# EAGLE design Mini ELRS 2.4GHz TX (EAGLE 9.6.2)
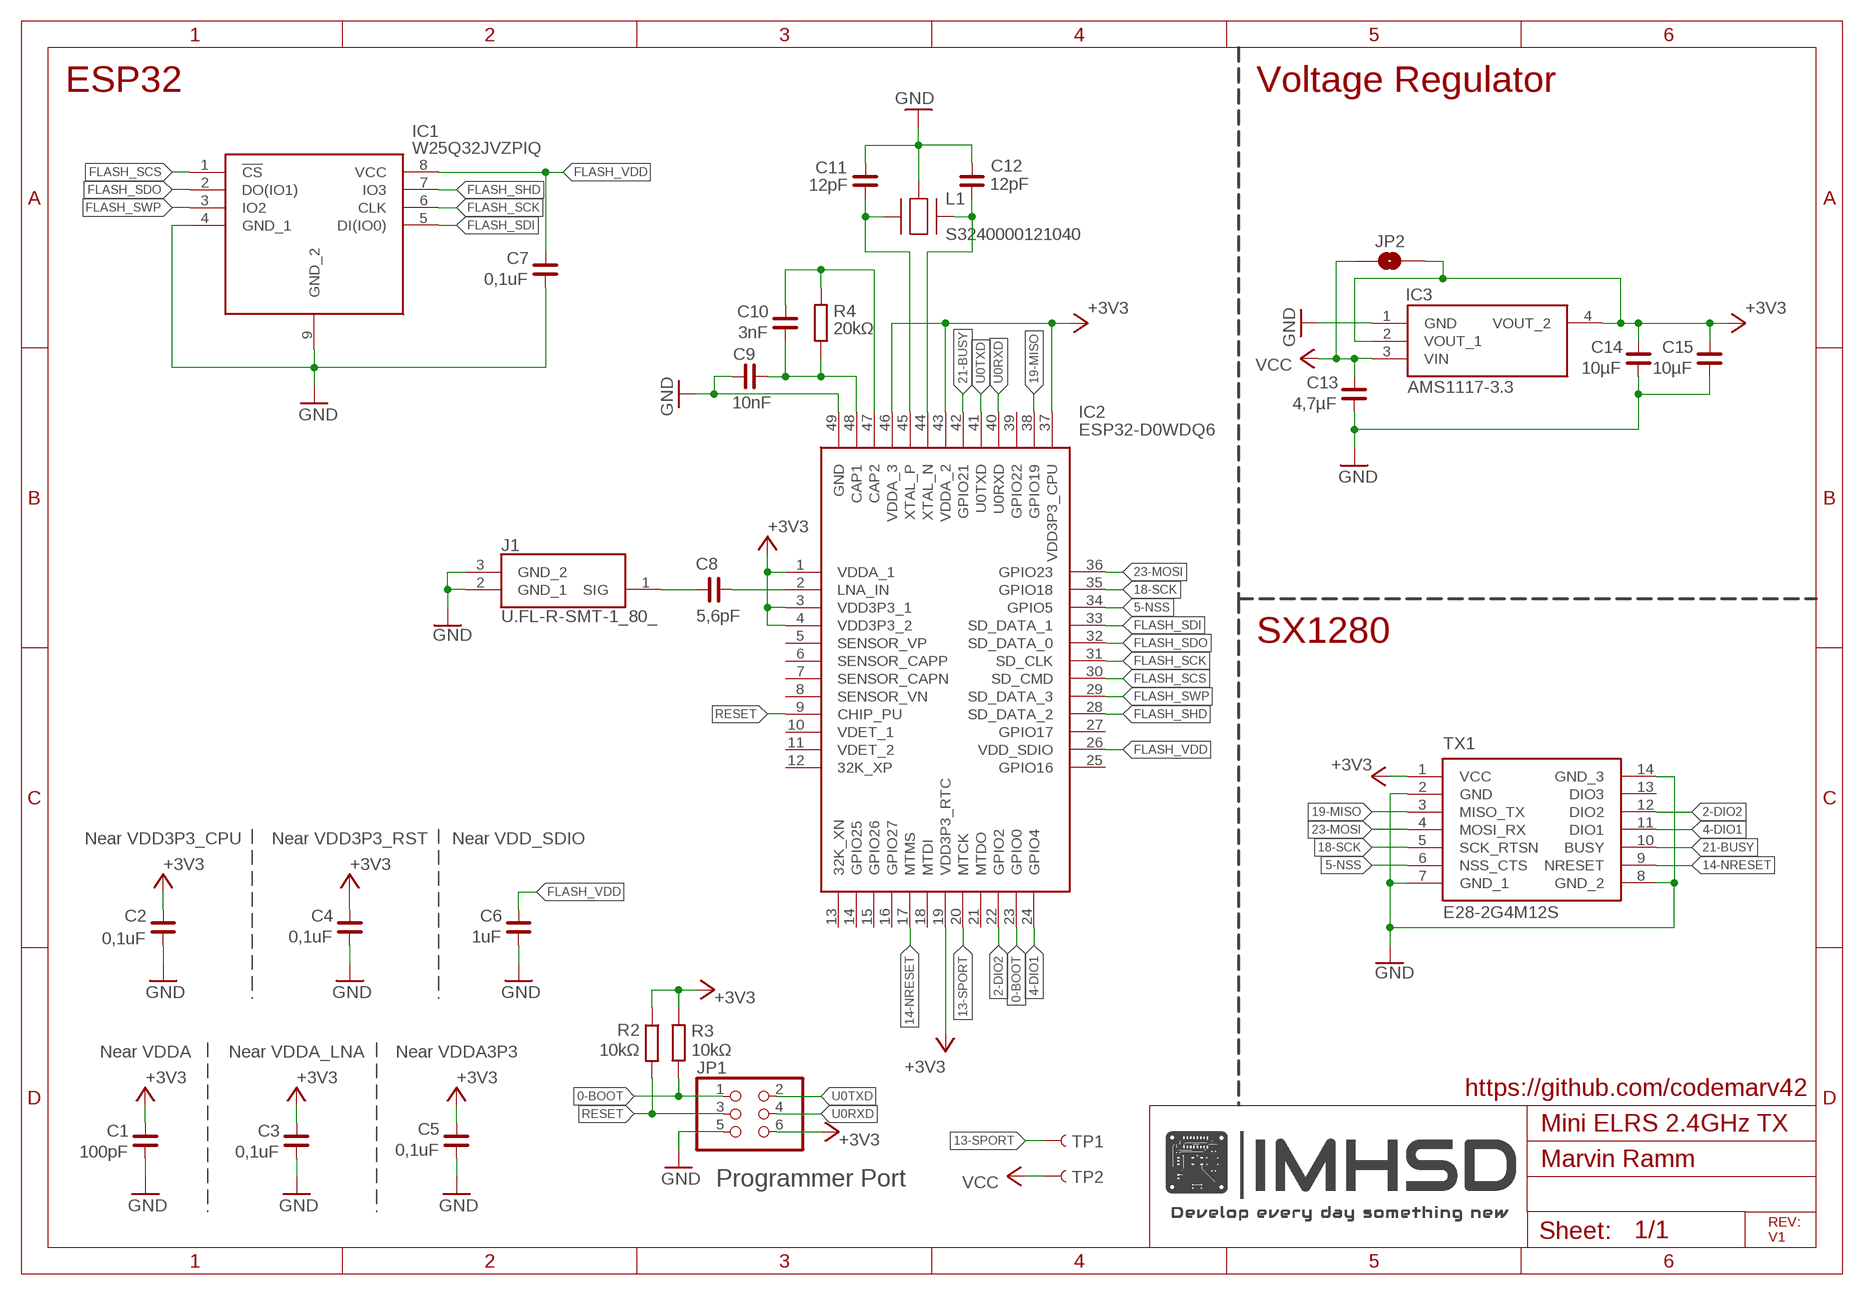
[diagram p0: schematic, sheet 1]

## Parts
C1  100pF  C_0402  [C0402]
C2  0,1uF  C_0402  [C0402]
C3  0,1uF  C_0402  [C0402]
C4  0,1uF  C_0402  [C0402]
C5  0,1uF  C_0402  [C0402]
C6  1uF  C_0402  [C0402]
C7  0,1uF  C_0402  [C0402]
C8  5,6pF  C_0402  [C0402]
C9  10nF  C_0402  [C0402]
C10  3nF  C_0402  [C0402]
C11  12pF  C_0402  [C0402]
C12  12pF  C_0402  [C0402]
C13  4,7µF  C_0603  [C0603]
C14  10µF  C_0603  [C0603]
C15  10µF  C_0603  [C0603]
IC1  W25Q128JVPIQ  [SON127P800X600X80-9N]
IC2  ESP32-D0WDQ6  [QFN40P600X600X90-49N]
IC3  AMS1117-3.3  [SOT229P700X180-4N]
J1  U.FL-R-SMT-1_80_  [UFLRSMT180]
JP1  ESP32_PRG_PORT  [ESP32_PRG_PORT]
JP2  JUMPER-SMT_2_NO_SILK  [SMT-JUMPER_2_NO_SILK]
L1  SMD-3225_4P16MHZ_20PF_10PPM_-4  [SMD3225_4P16MHZ20PF10PPM4085]
R2  10kΩ  R_0402  [R0402]
R3  10kΩ  R_0402  [R0402]
R4  20kΩ  R_0402  [R0402]
TP1  TEST-POINT3X5  [PAD.03X.05]
TP2  TEST-POINT3X5  [PAD.03X.05]
TX1  E28-2G4M12S  [E28-2G4M12S]

## Nets
0-BOOT: IC2.23(GPIO0) JP1.1 R3.2
2-DIO2: IC2.22(GPIO2) TX1.12(DIO2)
4-DIO1: IC2.24(GPIO4) TX1.11(DIO1)
5-NSS: IC2.34(GPIO5) TX1.6(NSS_CTS)
13-SPORT: IC2.20(MTCK) TP1.1
14-NRESET: IC2.17(MTMS) TX1.9(NRESET)
18-SCK: IC2.35(GPIO18) TX1.5(SCK_RTSN)
19-MISO: IC2.38(GPIO19) TX1.3(MISO_TX)
21-BUSY: IC2.42(GPIO21) TX1.10(BUSY)
23-MOSI: IC2.36(GPIO23) TX1.4(MOSI_RX)
+3V3: C1.2 C2.2 C3.2 C4.2 C5.2 C14.1 C15.1 IC2.1(VDDA_1) IC2.3(VDD3P3_1) IC2.4(VDD3P3_2) IC2.19(VDD3P3_RTC) IC2.37(VDD3P3_CPU) IC2.43(VDDA_2) IC2.46(VDDA_3) IC3.2(VOUT_1) IC3.4(VOUT_2) JP1.6 JP2.2 R2.2 R3.1 TX1.1(VCC)
FLASH_SCK: IC1.6(CLK) IC2.31(SD_CLK)
FLASH_SCS: IC1.1(!CS) IC2.30(SD_CMD)
FLASH_SDI: IC1.5(DI(IO0)) IC2.33(SD_DATA_1)
FLASH_SDO: IC1.2(DO(IO1)) IC2.32(SD_DATA_0)
FLASH_SHD: IC1.7(IO3) IC2.28(SD_DATA_2)
FLASH_SWP: IC1.3(IO2) IC2.29(SD_DATA_3)
FLASH_VDD: C6.2 C7.2 IC1.8(VCC) IC2.26(VDD_SDIO)
GND: C1.1 C2.1 C3.1 C4.1 C5.1 C6.1 C7.1 C9.1 C11.1 C12.1 C13.2 C14.2 C15.2 IC1.4(GND_1) IC1.9(GND_2) IC2.49(GND) IC3.1(GND) J1.2(GND_1) J1.3(GND_2) JP1.5 L1.2(GND_2) L1.4(GND_2) TX1.2(GND) TX1.7(GND_1) TX1.8(GND_2) TX1.14(GND_3)
N$1: C8.2 J1.1(SIG)
N$23: C8.1 IC2.2(LNA_IN)
N$24: C9.2 C10.1 IC2.48(CAP1) R4.2
N$25: C10.2 IC2.47(CAP2) R4.1
N$26: C12.2 IC2.44(XTAL_N) L1.3(CRYSTAL_2)
N$27: C11.2 IC2.45(XTAL_P) L1.1(CRYSTAL_1)
RESET: IC2.9(CHIP_PU) JP1.3 R2.1
U0RXD: IC2.40(U0RXD) JP1.4
U0TXD: IC2.41(U0TXD) JP1.2
VCC: C13.1 IC3.3(VIN) JP2.1 TP2.1
Unconnected: IC2.5(SENSOR_VP) IC2.6(SENSOR_CAPP) IC2.7(SENSOR_CAPN) IC2.8(SENSOR_VN) IC2.10(VDET_1) IC2.11(VDET_2) IC2.12(32K_XP) IC2.13(32K_XN) IC2.14(GPIO25) IC2.15(GPIO26) IC2.16(GPIO27) IC2.18(MTDI) IC2.21(MTDO) IC2.25(GPIO16) IC2.27(GPIO17) IC2.39(GPIO22) TX1.13(DIO3)

## Notes on the sheet
- ESP32 | Voltage Regulator
- W25Q32JVZPIQ
- S3240000121040
- SX1280
- Near VDD3P3_CPU | Near VDD3P3_RST | Near VDD_SDIO
- Near VDDA | Near VDDA_LNA | Near VDDA3P3
- https://github.com/codemarv42
- Marvin Ramm
- Programmer Port
- REV:
  V1

## Library data of the parts
C1-C15 = rc-master-smd:C_: NON-POLARIZED CAP
IC1 = W25Q128JVPIQ:W25Q128JVPIQ: IC FLASH 128M SPI 133MHZ 8WSON Source: Datasheet <https://www.arrow.com/en/products/w25q128jvpiq/winbond-electronics>; ARROW_PART_NUMBER: W25Q128JVPIQ; ARROW_PRICE-STOCK: https://www.arrow.com/en/products/w25q128jvpiq/winbond-electronics?region=nac; DESCRIPTION: IC FLASH 128M SPI 133MHZ 8WSON; HEIGHT: 0.8mm; MANUFACTURER_NAME: Winbond; MANUFACTURER_PART_NUMBER: W25Q128JVPIQ; MOUSER_PART_NUMBER: 454-W25Q128JVPIQ; MOUSER_PRICE-STOCK: https://www.mouser.co.uk/ProductDetail/Winbond/W25Q128JVPIQ?qs=qSfuJ%252Bfl%2Fd676hAD%252B1JSfw%3D%3D
IC2 = ESP32-D0WDQ6:ESP32-D0WDQ6: RF System on a Chip - SoC SMD IC ESP32-D0WDQ6, Dual Core MCU, WiFi & Bluetooth Combo, QFN48-pin, 6*6mm Source: Datasheet <https://www.espressif.com/sites/default/files/documentation/esp32_datasheet_en.pdf>; DESCRIPTION: RF System on a Chip - SoC SMD IC ESP32-D0WDQ6, Dual Core MCU, WiFi & Bluetooth Combo, QFN48-pin, 6*6mm; HEIGHT: 0.9mm; MANUFACTURER_NAME: Espressif Systems; MANUFACTURER_PART_NUMBER: ESP32-D0WDQ6; MOUSER_PART_NUMBER: 356-ESP32-D0WDQ6; MOUSER_PRICE-STOCK: https://www.mouser.co.uk/ProductDetail/Espressif-Systems/ESP32-D0WDQ6?qs=chTDxNqvsykWgzfXx0gR%252BQ%3D%3D
IC3 = AMS1117-3.3:AMS1117-3.3: 1A LOW DROPOUT VOLTAGE REGULATOR, SOT-223 Source: Datasheet <http://www.advanced-monolithic.com/pdf/ds1117.pdf>; ARROW_PART_NUMBER: AMS1117-3.3; DESCRIPTION: 1A LOW DROPOUT VOLTAGE REGULATOR, SOT-223; HEIGHT: 1.8mm; MANUFACTURER_NAME: Advanced Monolithic Systems; MANUFACTURER_PART_NUMBER: AMS1117-3.3
J1 = U.FL-R-SMT-1_80_:U.FL-R-SMT-1_80_: RF Connectors/Coaxial Connectors SMD RoHS Source: Datasheet <https://www.hirose.com/product/download/?distributor=digikey&type=2d&lang=en&num=U.FL-R-SMT-1(80)>; DESCRIPTION: RF Connectors/Coaxial Connectors SMD RoHS; HEIGHT: 1.45mm; MANUFACTURER_NAME: Hirose; MANUFACTURER_PART_NUMBER: U.FL-R-SMT-1(80); MOUSER_PART_NUMBER: 798-UFLRSMT180; MOUSER_PRICE-STOCK: https://www.mouser.co.uk/ProductDetail/Hirose-Connector/UFL-R-SMT-180?qs=PABxe4V6HDqFClp15N8Kig%3D%3D
JP1 = Eigene Library:ESP32_PRG_PORT
JP2 = SparkFun-Jumpers:JUMPER-SMT_2_NO: Normally open jumper This jumper has two pads in close proximity to each other. Apply solder to close the connection. Round pads are easier to solder for beginners, but are a lot larger. SparkFun Product that uses the round pads: SparkFun EL Sequencer <https://www.sparkfun.com/products/12781>
L1 = SMD-3225_4P16MHZ_20PF_10PPM_-4:SMD-3225_4P16MHZ_20PF_10PPM_-4: SMD-3225_4P16MHZ 20PF 10PPM -40~+85 Source: Datasheet <https://datasheet.lcsc.com/szlcsc/Zhejiang-Abel-Elec-SMD-3225-4P-16MHz-20pF-10ppm-40-85_C164049.pdf>; DESCRIPTION: SMD-3225_4P16MHZ 20PF 10PPM -40~+85; HEIGHT: 0.8mm; MANUFACTURER_NAME: TAE(Zhejiang Abel Elec); MANUFACTURER_PART_NUMBER: SMD-3225_4P16MHZ 20PF 10PPM -40~+85℃
R2-R4 = rc-master-smd:R_: RESISTOR
TP1 TP2 = SparkFun-Connectors:TEST-POINT: SparkFun Test Points Bare copper test points for troubleshooting or In-Circuit-Testing. These are used by our Production team for verifying production board runs using pogo-pins on test beds. SparkFun Products: SparkFun LSM9DS1 Breakout <https://www.sparkfun.com/products/13284> SparkFun PSOC <https://www.sparkfun.com/products/13714> SparkFun Load Cell Amplifier <https://www.sparkfun.com/products/13879>
TX1 = E28-2G4M12S:E28-2G4M12S; TX: >NAME

## Board
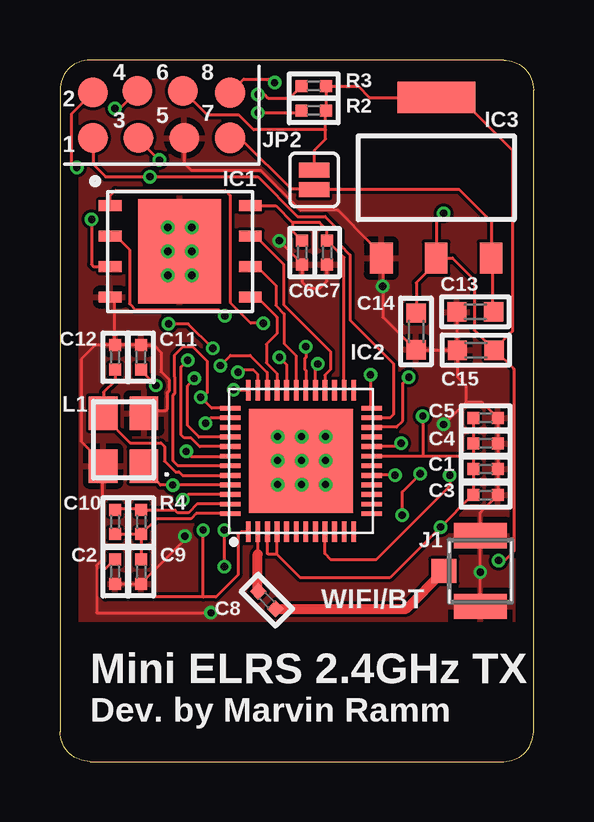
[diagram p1: board, top side]
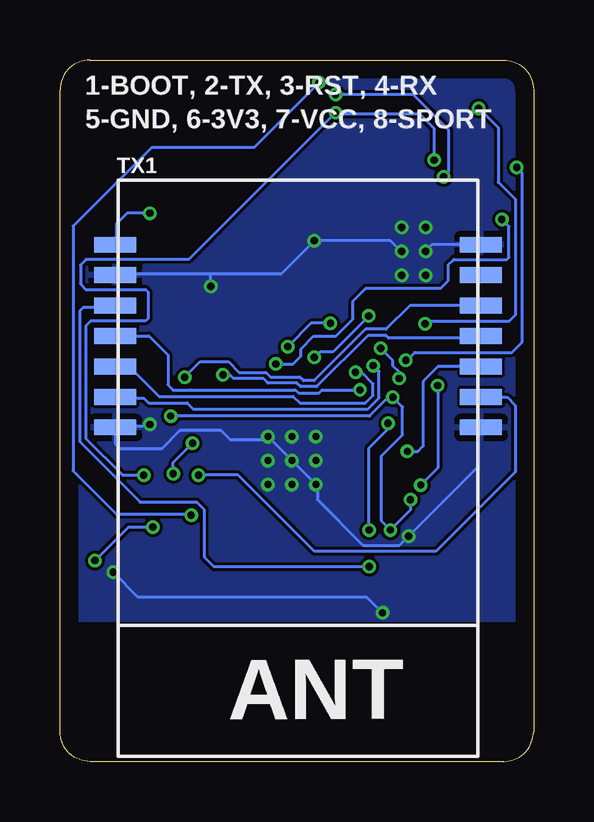
[diagram p2: board, bottom side, seen from below]

Size 19.75 x 29.25 mm. Coordinates in mm from the lower left corner, seen from the top.
Outline: 1.25,0 18.5,0 arc90 19.75,1.25 19.75,28 arc90 18.5,29.25 1.25,29.25 arc90 0,28 0,1.25 arc90 1.25,0
Copper layers (1*16): Top 0.035mm / dielectric 1.13mm / Bottom 0.035mm
Design rules "JLCPCB_1-2layer *": minimum track width 5mil, minimum drill 0.3mm, track to track 5mil, track to pad 0.2mm, pad to pad 7mil, via to via 7mil, smd to smd 7mil, copper to edge 30mil, drill to drill 6mil, minimum pad ring 6mil, minimum via ring 0.13mm, stop-mask expansion 0.1mm, vias tented up to drill 20mil, thermal gap 10mil
bKeepout: area 0,0 to 19.8,5.8
tRestrict: area 0,0 to 19.8,5.8; area 7.1,9.2 to 13.4,15.6; area 2.6,20.6 to 7,22.3
bRestrict: area 0,0 to 19.8,5.8
vRestrict: area 0,0 to 19.8,5.8

### Footprints (pad centres in the part's own frame; a part is rotated, then mirrored left to right if it is on the bottom)
C0402 = smd 0.5 x 0.5: 1 -0.508,0; 2 0.508,0
C0603 = smd 0.8 x 0.8: 1 -0.762,0; 2 0.762,0
SON127P800X600X80-9N = smd 0.95 x 0.45: 1 -2.85,1.905; 2 -2.85,0.635; 3 -2.85,-0.635; 4 -2.85,-1.905; 5 3,-1.905; 6 3,-0.635; 7 3,0.635; 8 3,1.905 | smd 3.45 x 4.35: 9 0.05,0
QFN40P600X600X90-49N = smd 0.85 x 0.2: 1 -2.95,2.2; 2 -2.95,1.8; 3 -2.95,1.4; 4 -2.95,1; 5 -2.95,0.6; 6 -2.95,0.2; 7 -2.95,-0.2; 8 -2.95,-0.6; 9 -2.95,-1; 10 -2.95,-1.4; 11 -2.95,-1.8; 12 -2.95,-2.2; 25 2.95,-2.2; 26 2.95,-1.8; 27 2.95,-1.4; 28 2.95,-1; 29 2.95,-0.6; 30 2.95,-0.2; 31 2.95,0.2; 32 2.95,0.6; 33 2.95,1; 34 2.95,1.4; 35 2.95,1.8; 36 2.95,2.2 | smd 0.2 x 0.85: 13 -2.2,-2.95; 14 -1.8,-2.95; 15 -1.4,-2.95; 16 -1,-2.95; 17 -0.6,-2.95; 18 -0.2,-2.95; 19 0.2,-2.95; 20 0.6,-2.95; 21 1,-2.95; 22 1.4,-2.95; 23 1.8,-2.95; 24 2.2,-2.95; 37 2.2,2.95; 38 1.8,2.95; 39 1.4,2.95; 40 1,2.95; 41 0.6,2.95; 42 0.2,2.95; 43 -0.2,2.95; 44 -0.6,2.95; 45 -1,2.95; 46 -1.4,2.95; 47 -1.8,2.95; 48 -2.2,2.95 | smd 4.35 x 4.35: 49 0,0
SOT229P700X180-4N = smd 1.3 x 0.95: 1 -3.35,2.29; 2 -3.35,0; 3 -3.35,-2.29 | smd 1.3 x 3.25: 4 3.35,0
UFLRSMT180 = smd 1 x 1.05: 1 0,-1.413 | smd 1.05 x 2.2: 2 -1.475,0.112; 3 1.475,0.112
ESP32_PRG_PORT = smd 1.25 x 1.25: 1 0,0; 2 1.9,0; 3 0,-1.9; 4 1.95,-1.85; 5 0,-3.8; 6 1.95,-3.75
SMT-JUMPER_2_NO_SILK = smd 0.635 x 1.27: 1 -0.406,0; 2 0.406,0
SMD3225_4P16MHZ20PF10PPM4085 = smd 1.4 x 1.2: 1 -1.1,-0.85; 2 1.1,-0.85; 3 1.1,0.85; 4 -1.1,0.85
R0402 = smd 0.5 x 0.5: 1 -0.508,0; 2 0.508,0
PAD.03X.05 = smd 1.27 x 1.27: 1 0,0
E28-2G4M12S = smd 1.75 x 0.65: 1 0.88,-0.33; 2 0.88,-1.6; 3 0.88,-2.87; 4 0.88,-4.14; 5 0.88,-5.41; 6 0.88,-6.68; 7 0.88,-7.95; 8 16.13,-7.95; 9 16.13,-6.68; 10 16.13,-5.41; 11 16.13,-4.14; 12 16.13,-2.87; 13 16.13,-1.6; 14 16.13,-0.33

### Placement (x,y rotation side)
C1  17.75,12.2 180 top
C2  2.3,7.92 90 top
C3  17.75,11.11 180 top
C4  17.75,13.27 180 top
C5  17.75,14.33 180 top
C6  10.1,21.22 90 top
C7  11.14,21.22 90 top
C8  8.63,6.73 315 top
C9  3.39,7.92 90 top
C10  2.3,9.99 90 top
C11  3.38,16.85 270 top
C12  2.3,16.85 270 top
C13  17.32,18.75 180 top
C14  14.85,17.93 270 top
C15  17.34,17.15 180 top
IC1  4.94,21.27 0 top
IC2  10.05,12.53 90 top
IC3  15.69,24.34 90 top
J1  17.42,7.94 270 top
JP1  1.38,26 90 top
JP2  10.6,24.25 90 top
L1  2.65,13.42 90 top
R2  10.58,27.14 0 top
R3  10.58,28.16 180 top
R4  3.39,9.99 270 top
TP1  7.09,27.89 0 top
TP2  7.1,26 0 top
TX1  18.32,21.88 0 bottom

### Tracks (layer width: path | path; a pad name or v marks a point on that pad's centre or on a via)
0-BOOT  (via drill 0.3)
  Top 0.127: JP1.1 1.4,26.04 1.65,26.29 JP1.1 | v8.26,27.81 8.53,27.81 8.68,27.66 9.58,27.66 R3.2 | IC2.23 13.77,14.33 13.92,14.47 13.92,16.59 12.1,18.4 12.1,21.12 11.68,21.54 11.68,22.1 11.05,22.73 9.91,22.73 8.26,24.38 v3.75,24.38 1.9,24.38 1.38,24.9 JP1.1
  Bottom 0.127: v8.26,27.81 5.03,27.81 3.55,26.34 3.55,24.58 v3.75,24.38
2-DIO2  (via drill 0.3)
  Top 0.127: IC2.22 13.01,13.94 14.03,13.94 14.29,14.2 14.29,15.77 v14.55,16.02
  Bottom 0.127: v14.55,16.02 13.9,16.67 12.73,16.67 12.28,16.23 11.16,16.23 10.97,16.04 9.75,16.04 9.6,15.88 9.15,15.88 7.01,18.02 6.15,18.02 5.17,19.01 TX1.12
4-DIO1  (via drill 0.3)
  Top 0.127: v12.95,16.13 12.95,14.73 IC2.24
  Bottom 0.127: TX1.11 2.29,17.65 6.03,17.65 6.15,17.77 6.9,17.77 9.04,15.63 9.71,15.63 9.86,15.78 11.08,15.78 11.27,15.97 12.52,15.97 12.67,16.13 v12.95,16.13
5-NSS  (via drill 0.3)
  Top 0.127: v6.69,16.51 7.11,16.93 7.93,16.93 8.64,16.23 8.64,15.49 IC2.34
  Bottom 0.127: TX1.6 17.44,15.15 16.25,15.15 16.05,14.95 14.44,14.95 14.19,14.7 6.91,14.7 6.44,15.16 6.44,16.26 v6.69,16.51
13-SPORT  (via drill 0.3)
  Top 0.127: v8.95,28.31 8.95,28.36 8.86,28.46 7.66,28.46 TP1.1 | v14.28,10.28 14.28,11.25 v15.03,12 | v14.22,13.28 14.08,13.13 IC2.20
  Bottom 0.127: v8.95,28.31 11.66,25.6 15.93,25.6 19.2,22.32 19.2,12.12 17.4,10.32 14.28,10.32 v14.28,10.28 | v15.03,12 15.03,12.47 v14.22,13.28
14-NRESET  (via drill 0.3)
  Top 0.127: v13.97,11.94 13.08,11.94 IC2.17
  Bottom 0.127: v13.97,11.94 12.32,11.94 9.14,8.76 4.08,8.76 0.77,12.07 0.77,14.85 1.1,15.19 2.19,15.19 TX1.9
18-SCK  (via drill 0.3)
  Top 0.127: IC2.35 8.24,15.49 8.24,16.16 8.07,16.33 7.53,16.33 v7.42,16.23
  Bottom 0.127: TX1.5 16.87,16.47 15.62,15.23 10.02,15.23 9.75,14.95 7.01,14.95 6.7,15.27 6.7,15.75 7.18,16.23 v7.42,16.23
19-MISO  (via drill 0.3)
  Top 0.127: IC2.38 6.3,14.33 v6.07,14.1 | v6.86,8.13 v6.86,9.65
  Bottom 0.127: v6.07,14.1 6.07,13.87 6.86,13.08 v6.86,9.65 | v6.86,8.13 13.34,8.13 13.73,8.52 13.73,10.5 14.05,10.82 16.41,10.82 18.92,13.34 18.92,18.79 18.79,18.92 17.53,18.92 TX1.3
21-BUSY  (via drill 0.3)
  Top 0.127: v5.26,12.93 5.47,12.72 7.08,12.72 IC2.42
  Bottom 0.127: v5.26,12.93 4.82,12.93 4.61,13.15 4.61,15.84 3.96,16.48 2.2,16.48 TX1.10
23-MOSI  (via drill 0.3)
  Top 0.127: v7.24,15.49 7.87,15.49 IC2.36
  Bottom 0.127: 17.4,17.65 TX1.4 16.04,17.74 15.25,16.95 15.25,15.7 15.03,15.48 14.32,15.48 14.31,15.49 9.93,15.49 9.81,15.37 8.94,15.37 8.82,15.49 v7.24,15.49
+3V3  (via drill 0.3)
  Top 0.127: C5.2 C4.2 17.24,12.72 | 17.24,12.72 C1.2 C3.2 17.14,11.05 v15.88,9.78 13.76,7.66 10.02,7.66 9.05,8.64 | IC2.19 15.13,12.73 | 15.13,12.73 17.24,12.73 17.24,12.72 | 9.05,8.64 9.04,8.64 9.04,9.57 IC2.4 | 6.99,12.32 IC2.43 4.98,12.33 4.92,12.33 4.72,12.53 4.72,15.27 4.8,15.35 4.8,16.01 4.78,16.02 4.78,16.96 5.12,17.3 5.53,17.3 6.14,16.69 6.14,15.37 5.96,15.19 v5.87,15.19 6.33,14.73 IC2.37 | C2.2 2.28,8.43 1.78,7.92 1.78,6.99 1.91,6.86 5.97,6.86 | 5.97,6.86 6.5,6.86 7.42,7.78 7.42,9.45 7.55,9.58 IC2.1 | 5.97,6.86 v5.97,9.65 | v15.13,14.4 15.13,12.73 | IC3.2 15.69,20.8 14.86,19.97 14.86,18.8 C14.1 | C15.1 18.09,17.17 17.27,17.99 17.27,20.08 16.36,20.99 IC3.2 | v16,22.86 15.7,22.56 15.7,21.01 IC3.2 | 11.1,28.19 11.1,28.15 | 11.1,28.15 11.1,27.15 R2.2 11.07,27.11 11.07,26.34 | 11.1,28.15 R3.1 12.44,28.16 12.91,27.69 15.73,27.69 | 11.07,26.34 11.07,25.95 10.6,25.47 JP2.2 | 11.07,26.34 8.08,26.34 7.47,26.95 6.16,26.95 5.16,27.95 JP1.6 | C15.1 18.1,17.17 18.87,17.94 18.87,25.49 16.74,27.62 15.73,27.69 | 15.73,27.69 IC3.4 | v18.29,8.38 18.54,8.38 18.92,8.76 18.92,16.38 18.16,17.14 C15.1 | 9.05,8.64 8.69,8.64 8.65,8.68 IC2.3 | IC2.46 5.34,11.13 v5.13,10.92
  Bottom 0.127: v5.97,9.65 | v5.97,9.65 6.35,10.03 6.35,12.73 5.46,13.62 5.46,14.78 v5.87,15.19 6.06,15.19 6.84,14.4 v15.13,14.4 | v16,22.86 16.95,22.86 17.4,22.41 17.4,21.59 TX1.1 | v18.29,8.38 16.89,9.78 v15.88,9.78 | v5.13,10.92 5.13,10.49 v5.97,9.65
FLASH_SCK
  Top 0.127: IC1.6 8.21,20.64 9,19.85 9,19.01 9.35,18.67 9.35,17.42 9.85,16.92 IC2.31
FLASH_SCS  (via drill 0.3)
  Top 0.127: IC1.1 2.09,23.59 2.31,23.81 6.9,23.81 7.1,23.6 7.1,19.13 7.96,18.27 v8.47,18.27 | v10.25,17.3 10.25,16.85 10.2,16.8 10.2,16.35 10.25,16.31 IC2.30
  Bottom 0.127: v8.47,18.27 9.28,18.27 v10.25,17.3
FLASH_SDI
  Top 0.127: IC1.5 8.21,19.36 9.05,18.52 9.05,17.84 8.61,17.4 8.61,16.62 9.05,16.18 IC2.33
FLASH_SDO  (via drill 0.3)
  Top 0.127: IC1.2 2.34,21.91 2.9,21.34 2.9,19.09 3.16,18.83 6.62,18.83 v6.88,18.57 | v9.15,16.85 9.45,16.55 IC2.32
  Bottom 0.127: v6.88,18.57 8.38,17.07 8.9,17.07 9.12,16.85 v9.15,16.85
FLASH_SHD
  Top 0.127: IC1.7 8.16,21.91 9.33,20.74 9.33,19.04 11.29,17.09 11.29,16.35 11.05,16.11 IC2.28
FLASH_SWP  (via drill 0.3)
  Top 0.127: IC2.29 10.65,16.48 v10.75,16.58 | v1.32,22.6 1.32,20.73 1.42,20.64 IC1.3
  Bottom 0.127: v10.75,16.58 10.03,16.58 9.71,16.9 9.71,17.19 9.17,17.73 8.25,17.73 7.53,18.46 7.53,19.2 6.99,19.73 3.88,19.73 3.55,20.05 3.55,20.71 3.33,20.94 1.11,20.94 1.03,21.02 1.03,22.31 v1.32,22.6
FLASH_VDD
  Top 0.127: IC1.8 9,23.18 9.7,22.48 | 9.7,22.48 9.7,22.12 C6.2 10.1,21.75 10.12,21.73 | IC2.26 11.85,21.02 C7.2 11.14,22.16 10.82,22.48 9.7,22.48
GND  (via drill 0.3)
  Top 0.127: C5.1 C4.1 C1.1 C3.1 17.53,10.38 J1.2 v17.53,7.9 J1.3 | C2.1 C9.1 3.41,7.45 5.21,9.25 v5.21,9.4 | IC1.4 2.25,19.2 2.25,17.41 C12.1 | C12.1 C11.1 3.92,17.36 4.22,17.06 4.22,16.25 4.54,15.93 4.54,15.45 4.47,15.38 4.47,14.69 4.38,14.61 3.56,14.61 L1.2 | 9.14,12.45 9.14,11.56 v9.07,11.55 | v10.07,11.55 10.16,11.56 10.16,12.45 IC2.49 | 11.18,12.45 11.18,11.56 v11.07,11.55 | 9.14,12.45 v9.07,12.55 | 9.14,12.45 IC2.49 | v10.07,12.55 10.16,12.57 IC2.49 | 11.18,12.45 v11.07,12.55 | 11.18,12.45 IC2.49 | 10.03,13.59 9.14,13.59 v9.07,13.55 | 10.03,13.59 v10.07,13.55 10.16,13.59 11.05,13.59 v11.07,13.55 | 10.03,13.59 IC2.49 | 4.57,21.21 4.57,20.32 v4.5,20.27 | 4.57,21.21 v4.5,21.27 | 4.57,21.21 IC1.9 | 5.46,22.35 4.57,22.35 v4.5,22.27 | 5.59,21.21 5.59,20.32 v5.5,20.27 | 5.59,21.21 v5.5,21.27 | 5.59,21.21 IC1.9 | 5.46,22.35 v5.5,22.27 | 5.46,22.35 IC1.9 | v9.14,21.72 10.03,20.83 C6.1 10.1,20 10.35,19.75 10.85,19.75 11.14,20.04 C7.1 | C12.1 1.47,17.36 0.89,16.77 0.89,13.34 1.78,12.45 L1.4 1.78,12.32 1.78,8.43 1.52,8.18 1.52,6.2 v6.3,6.2 | C15.2 16.51,17.14 14.86,17.14 C14.2 14.81,17.17 13.46,18.52 v13.46,19.81 13.46,20.95 IC3.1 12.97,21.59 11.58,22.98 10.04,22.98 8.38,24.64 5.49,24.64 5.18,24.95 JP1.5 | C15.2 16.56,17.17 C13.2 | C15.2 | C5.1 | C5.1 17.61,14.97 16.92,14.97 | 16.92,14.97 v16,14.05 | C15.2 16.58,16.02 16.92,15.68 16.92,14.97
  Bottom 0.127: TX1.8 2.29,13.84 2.29,12.32 v5.21,9.4 5.59,9.02 7.11,9.02 9.02,10.92 9.02,11.43 v9.07,11.55 v10.07,12.55 v11.07,13.55 11.2,13.43 12.65,13.43 13.04,13.82 14.73,13.82 15.5,13.05 17.25,13.05 17.44,13.24 TX1.7 | 17.4,13.84 TX1.7 | v5.5,21.27 5.59,21.34 5.97,21.72 v9.14,21.72 10.54,20.32 13.46,20.32 | TX1.14 2.2,21.56 4.22,21.56 4.45,21.34 v4.5,21.27 | 13.46,20.32 17.4,20.32 TX1.2 | v13.46,19.81 13.46,20.32 | v16,14.05 16.09,13.97 17.4,13.97 TX1.7 | v6.3,6.2 6.95,6.85 16.48,6.85 v17.53,7.9
  pour Top: 0,29.25 19.75,29.25 19.75,1.1 19.75,0 1.05,0 0,0
  pour Bottom: 0,29.25 19.75,29.25 19.75,2.8 19.75,0 15.15,0 0,0
N$1
  Top 0.406: C8.2 14.44,6.37 J1.1
N$23
  Top 0.127: 8.25,7.11 C8.1 | 8.25,8.65 IC2.2
  Top 0.406: C8.1 8.25,7.11 8.25,8.65
N$24
  Top 0.127: C10.1 R4.2 | R4.2 C9.2 | IC2.48 5.68,10.34 5.46,10.12 4.03,10.12 3.43,9.53 R4.2
N$25
  Top 0.127: C10.2 2.41,10.54 3.3,10.54 R4.1 3.41,10.47 4.81,10.47 4.91,10.38 5.36,10.38 5.71,10.73 IC2.47
N$26
  Top 0.127: L1.3 1.82,14.5 | IC2.44 5.11,11.93 4.96,12.07 4.82,12.07 4.36,12.53 4.36,13.13 4.21,13.28 2.94,13.28 1.82,14.4 1.82,14.5 | C12.2 2.3,15.88 1.82,15.4 1.82,14.5
N$27  (via drill 0.3)
  Top 0.127: L1.1 3.5,12.22 4.19,11.53 v4.7,11.53 IC2.45 | v4,15.68 3.38,16.3 C11.2
  Bottom 0.127: v4.7,11.53 4,12.23 v4,15.68
RESET  (via drill 0.3)
  Top 0.127: v8.26,27.05 10.03,27.05 R2.1 | JP1.3 3.22,26 v4.14,25.08 | IC2.9 11.05,9.53 11.05,8.67 11.3,8.41 13.18,8.41 16.26,11.49 v16.26,11.94
  Bottom 0.127: v4.14,25.08 4.14,26.38 4.77,27 8.21,27 v8.26,27.05 14.38,20.93 18.66,20.93 18.89,20.7 18.89,19.91 18.67,19.68 16.18,19.68 16.08,19.58 16.08,18.47 16.18,18.36 18.46,18.36 18.67,18.16 18.67,13.46 17.14,11.94 v16.26,11.94
U0RXD  (via drill 0.3)
  Top 0.127: IC2.40 5.79,13.53 5.32,14 5.32,15.67 5.6,15.95 v5.6,15.97 | v6.38,17.23 5.35,18.25 v4.53,18.25 | JP1.4 2.51,27.23 v2.29,27.23
  Bottom 0.127: v5.6,15.97 5.6,16.23 5.87,16.5 5.87,16.72 v6.38,17.23 | v4.53,18.25 4.53,18.3 4.46,18.37 1.01,18.37 0.75,18.63 0.75,23.43 1.48,24.15 1.48,26.42 v2.29,27.23
U0TXD  (via drill 0.3)
  Top 0.127: JP1.2 0.47,27 0.47,25 v0.7,24.77 | IC2.41 5.83,13.13 5.46,13.5 5.18,13.5 5.05,13.62 5.05,16.45 v5.33,16.73
  Bottom 0.127: v5.33,16.73 5.28,16.73 4.95,17.06 0.9,17.06 0.47,17.48 0.47,24.55 v0.7,24.77
VCC
  Top 0.127: C13.1 18.03,18.8 18.03,20.95 IC3.3 17.98,22.52 16.65,23.85 JP2.1 10.54,23.88 9.62,23.88 7.59,25.91 7.11,25.91 TP2.1

### Text on the board
tPlace: 4 | 6 | 8 | 2 | 5 | 7 | 3 | 1 | WIFI/BT | Mini ELRS 2.4GHz TX | Dev. by Marvin Ramm
bPlace: 1-BOOT, 2-TX, 3-RST, 4-RX | 5-GND, 6-3V3, 7-VCC, 8-SPORT